# Altium schematic sheet Modulator.SchDoc: Audio modulator
size A4; Engineer: CT; SheetNumber: 3; SheetTotal: 4
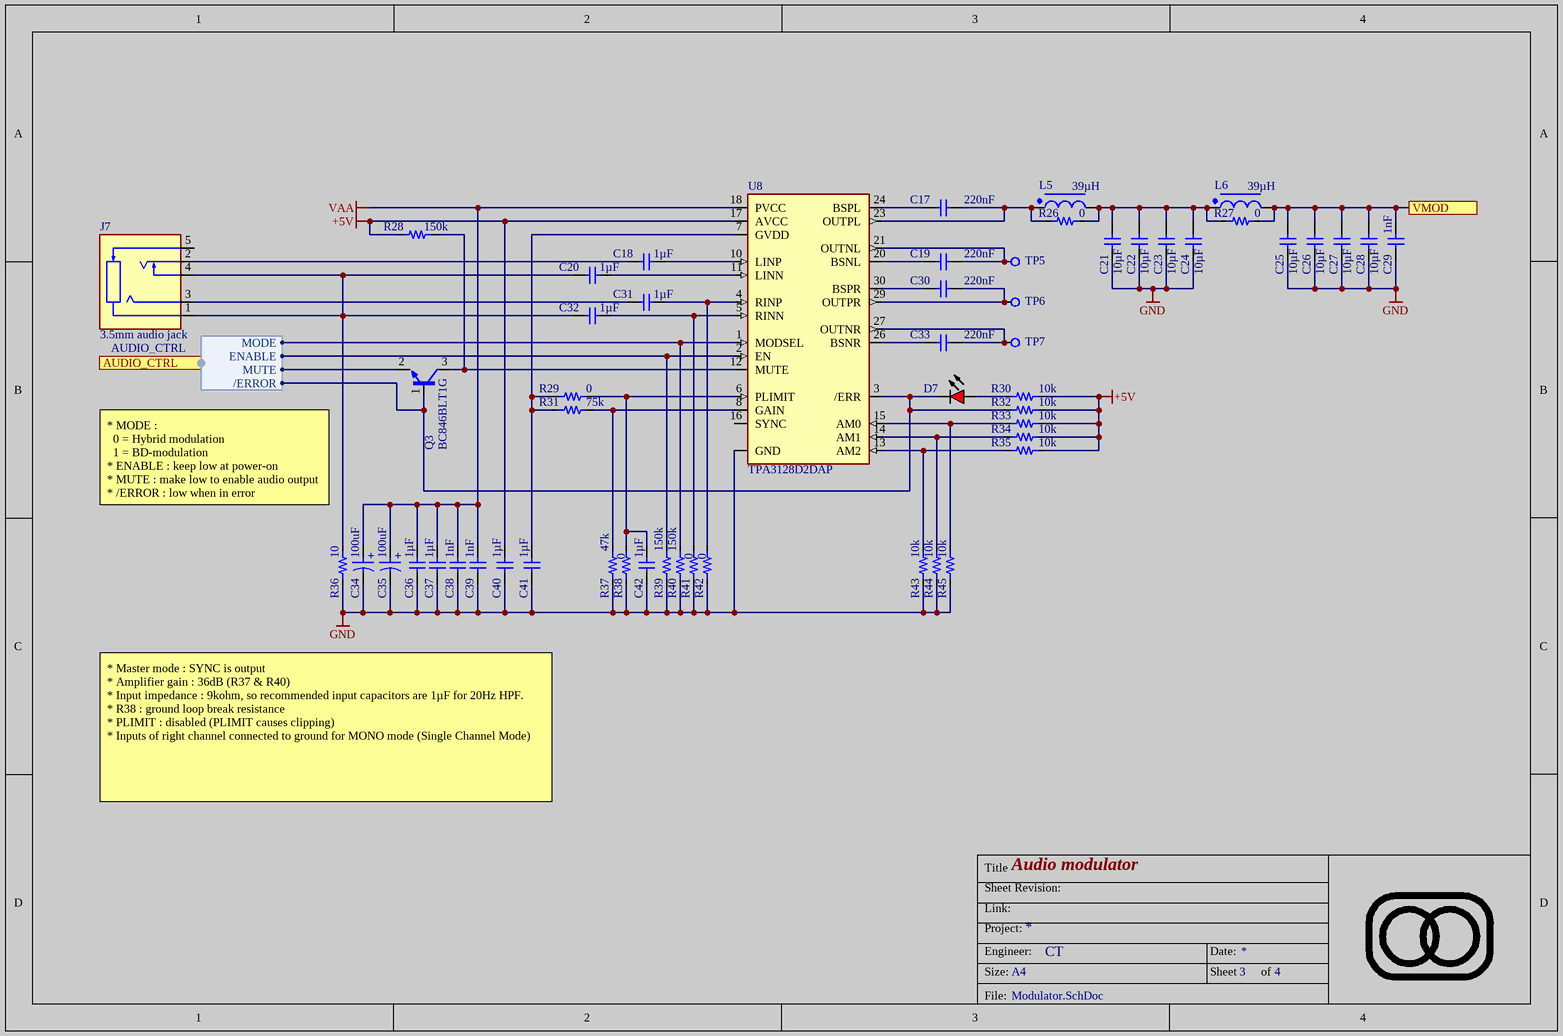
[diagram p0: Modulator.SchDoc]

## Parts
C17  value 220nF  [0805-C-N]  (hidden comment: Capacitor 220nF +/-10% 50V X7R 0805)
C18  value 1µF  [1206-C-N]  (hidden comment: Capacitor 1µF +/-10% 50V X7R 1206)
C19  value 220nF  [0805-C-N]  (hidden comment: Capacitor 220nF +/-10% 50V X7R 0805)
C20  value 1µF  [1206-C-N]  (hidden comment: Capacitor 1µF +/-10% 50V X7R 1206)
C21  value 10µF  [WCAP-CSGP_1210_L3.2W2.5H2.5]  (hidden comment: Capacitor 10µF +/-10% 50V X7R 1210)
C22  value 10µF  [WCAP-CSGP_1210_L3.2W2.5H2.5]  (hidden comment: Capacitor 10µF +/-10% 50V X7R 1210)
C23  value 10µF  [WCAP-CSGP_1210_L3.2W2.5H2.5]  (hidden comment: Capacitor 10µF +/-10% 50V X7R 1210)
C24  value 10µF  [WCAP-CSGP_1210_L3.2W2.5H2.5]  (hidden comment: Capacitor 10µF +/-10% 50V X7R 1210)
C25  value 10µF  [WCAP-CSGP_1210_L3.2W2.5H2.5]  (hidden comment: Capacitor 10µF +/-10% 50V X7R 1210)
C26  value 10µF  [WCAP-CSGP_1210_L3.2W2.5H2.5]  (hidden comment: Capacitor 10µF +/-10% 50V X7R 1210)
C27  value 10µF  [WCAP-CSGP_1210_L3.2W2.5H2.5]  (hidden comment: Capacitor 10µF +/-10% 50V X7R 1210)
C28  value 10µF  [WCAP-CSGP_1210_L3.2W2.5H2.5]  (hidden comment: Capacitor 10µF +/-10% 50V X7R 1210)
C29  value 1nF  [0603-C-N]  (hidden comment: Capacitor 1nF +/-10% 100V X7R 0603)
C30  value 220nF  [0805-C-N]  (hidden comment: Capacitor 220nF +/-10% 50V X7R 0805)
C31  value 1µF  [1206-C-N]  (hidden comment: Capacitor 1µF +/-10% 50V X7R 1206)
C32  value 1µF  [1206-C-N]  (hidden comment: Capacitor 1µF +/-10% 50V X7R 1206)
C33  value 220nF  [0805-C-N]  (hidden comment: Capacitor 220nF +/-10% 50V X7R 0805)
C34  Capacitance: 100uF  [WCAP-HSAH_D6.3H7.7]  (hidden comment: 875585545003)
C35  Capacitance: 100uF  [WCAP-HSAH_D6.3H7.7]  (hidden comment: 875585545003)
C36  value 1µF  [1206-C-N]  (hidden comment: Capacitor 1µF +/-10% 50V X7R 1206)
C37  value 1µF  [1206-C-N]  (hidden comment: Capacitor 1µF +/-10% 50V X7R 1206)
C38  value 1nF  [0603-C-N]  (hidden comment: Capacitor 1nF +/-10% 100V X7R 0603)
C39  value 1nF  [0603-C-N]  (hidden comment: Capacitor 1nF +/-10% 100V X7R 0603)
C40  value 1µF  [1206-C-N]  (hidden comment: Capacitor 1µF +/-10% 50V X7R 1206)
C41  value 1µF  [1206-C-N]  (hidden comment: Capacitor 1µF +/-10% 50V X7R 1206)
C42  value 1µF  [1206-C-N]  (hidden comment: Capacitor 1µF +/-10% 50V X7R 1206)
D7  150060RS86000  [WL-SMCW_0603_150060xx8x000]  (value not drawn)
J7  3.5mm audio jack  [SJ2-35863B1-SMT-TR-Footprint-1]
L5  Inductance: 39µH  [WE-PD2_1054]  (hidden comment: 744776139)
L6  Inductance: 39µH  [WE-PD2_1054]  (hidden comment: 744776139)
Q3  BC846BLT1G  [SOT-23-3-N]
R26  value 0  [1206-R-N]  (hidden comment: Jumper 0R <50 mOhm 2A 1206)
R27  value 0  [1206-R-N]  (hidden comment: Jumper 0R <50 mOhm 2A 1206)
R28  value 150k  [0603-R-N]  (hidden comment: Resistor 150k +/-1% 50V 0603)
R29  value 0  [0603-R-N]  (hidden comment: Jumper 0R <50 mOhm 1A 0603)
R30  value 10k  [0603-R-N]  (hidden comment: Resistor 10k +/-1% 50V 0603)
R31  value 75k  [0603-R-N]  (hidden comment: Resistor 75k +/-1% 50V 0603)
R32  value 10k  [0603-R-N]  (hidden comment: Resistor 10k +/-1% 50V 0603)
R33  value 10k  [0603-R-N]  (hidden comment: Resistor 10k +/-1% 50V 0603)
R34  value 10k  [0603-R-N]  (hidden comment: Resistor 10k +/-1% 50V 0603)
R35  value 10k  [0603-R-N]  (hidden comment: Resistor 10k +/-1% 50V 0603)
R36  value 10  [0603-R-N]  (hidden comment: Resistor 10R +/-1% 50V 0603)
R37  value 47k  [0603-R-N]  (hidden comment: Resistor 47k +/-1% 50V 0603)
R38  value 0  [0603-R-N]  (hidden comment: Jumper 0R <50 mOhm 1A 0603)
R39  value 150k  [0603-R-N]  (hidden comment: Resistor 150k +/-1% 50V 0603)
R40  value 150k  [0603-R-N]  (hidden comment: Resistor 150k +/-1% 50V 0603)
R41  value 0  [0603-R-N]  (hidden comment: Jumper 0R <50 mOhm 1A 0603)
R42  value 0  [0603-R-N]  (hidden comment: Jumper 0R <50 mOhm 1A 0603)
R43  value 10k  [0603-R-N]  (hidden comment: Resistor 10k +/-1% 50V 0603)
R44  value 10k  [0603-R-N]  (hidden comment: Resistor 10k +/-1% 50V 0603)
R45  value 10k  [0603-R-N]  (hidden comment: Resistor 10k +/-1% 50V 0603)
TP5  Testpad with multiple sizes  [TP_1.5mm]  (value not drawn)  (no BOM)
TP6  Testpad with multiple sizes  [TP_1.5mm]  (value not drawn)  (no BOM)
TP7  Testpad with multiple sizes  [TP_1.5mm]  (value not drawn)  (no BOM)
U8  TPA3128D2DAP  [TSSOP28_PPad]

## Ports
AUDIO_CTRL (harness AUDIO_CTRL), VMOD

## Harnesses
AUDIO_CTRL: MODE, ENABLE, MUTE, /ERROR

## Nets
+5V: C40.2 R28.1 R30.2 R32.1 R33.1 R34.1 R35.1 U8.17(AVCC)
GND: C21.1 C22.1 C23.1 C24.1 C25.1 C26.1 C27.1 C28.1 C29.1 C34.2(N) C35.2(N) C36.2 C37.2 C38.1 C39.1 C40.1 C41.1 C42.1 R36.1 R37.1 R38.1 R39.1 R40.1 R41.1 R42.1 R43.2 R44.2 R45.2 U8.9(GND)
VAA: C34.1(P) C35.1(P) C36.1 C37.1 C38.2 C39.2 U8.18(PVCC)
VMOD: C25.2 C26.2 C27.2 C28.2 C29.2 L6.2 R27.2 ; port VMOD
NetC17_1: C17.1 U8.24(BSPL)
NetC17_2: C17.2 L5.1 R26.1 U8.23(OUTPL)
NetC18_1: C18.1 U8.10(LINP)
NetC18_2: C18.2 J7.2
NetC19_1: C19.1 U8.20(BSNL)
NetC19_2: C19.2 TP5.1(Pad) U8.21(OUTNL)
NetC20_1: C20.1 U8.11(LINN)
NetC20_2: C20.2 C32.2 J7.1 J7.4 R36.2
NetC21_2: C21.2 C22.2 C23.2 C24.2 L5.2 L6.1 R26.2 R27.1
NetC30_1: C30.1 U8.30(BSPR)
NetC30_2: C30.2 TP6.1(Pad) U8.29(OUTPR)
NetC31_1: C31.1 R42.2 U8.4(RINP)
NetC31_2: C31.2 J7.3
NetC32_1: C32.1 R41.2 U8.5(RINN)
NetC33_1: C33.1 U8.26(BSNR)
NetC33_2: C33.2 TP7.1(Pad) U8.27(OUTNR)
NetC41_2: C41.2 R29.1 R31.2 U8.7(GVDD)
NetC42_2: C42.2 R29.2 R38.2 U8.6(PLIMIT)
NetD7_1: D7.1(K) Q3.1(B) R32.2 U8.3(/ERR) ; port AUDIO_CTRL./ERROR
NetD7_2: D7.2(A) R30.1
NetQ3_2: Q3.2(E) ; port AUDIO_CTRL.MUTE
NetQ3_3: Q3.3(C) R28.2 U8.12(MUTE)
NetR31_1: R31.1 R37.2 U8.8(GAIN)
NetR33_2: R33.2 R45.1 U8.15(AM0)
NetR34_2: R34.2 R44.1 U8.14(AM1)
NetR35_2: R35.2 R43.1 U8.13(AM2)
NetR39_2: R39.2 U8.2(EN) ; port AUDIO_CTRL.ENABLE
NetR40_2: R40.2 U8.1(MODSEL) ; port AUDIO_CTRL.MODE

Not connected (* = marked no-connect by the designer): J7 5; U8 16(SYNC)

## Notes on the sheet
- * MODE :
  0 = Hybrid modulation
  1 = BD-modulation
  * ENABLE : keep low at power-on
  * MUTE : make low to enable audio output
  * /ERROR : low when in error
- * Master mode : SYNC is output
  * Amplifier gain : 36dB (R37 & R40)
  * Input impedance : 9kohm, so recommended input capacitors are 1µF for 20Hz HPF.
  * R38 : ground loop break resistance
  * PLIMIT : disabled (PLIMIT causes clipping)
  * Inputs of right channel connected to ground for MONO mode (Single Channel Mode)
- Title
- Sheet Revision:
- Link:
- Size:
- Project:
- Engineer:
- A4
- Date:
- Sheet
- of
- File:
- (in symbol CMP-171-000008-2) +

## Library data of the parts
C17 C19 C30 C33 = CMP-072-000738-14: WCAP-CSGP Multilayer Ceramic Chip Capacitor, General Purpose, size 0805, X7R, 220nF, 50VDC; Capacitor Type: MLCC; Technical Reference: X7R0805224K050DFCT10000; Insulation Resistance: 2.3GO; Dissipation Factor: 3%; Tolerance: 10%; Width: 1.25mm; Dielectric: X7R; Case/Package: 0805; ComponentLink2Description: Datasheet Link; Usage: General Purpose; Pins: 2; JLCPCB Part #: C5378; Design Item ID: 885012207100; ComponentLink2URL: https://www.we-online.com/redexpert/spec/885012207100?ad; Max Operating Temperature: 125°C; Length: 2mm; Source: WCAP-CSGP.SchLib; Packaging: Tape and Reel; ComponentLink1URL: https://www.we-online.com/redexpert/article/885012207100?ad; Match Code: WCAP-CSGP; Voltage Rating: 50V; ComponentLink1Description: Website Link; Mounting Technology: SMT; Height: 1.25mm; Min Operating Temperature: -55°C
C18 C20 C31 C32 C36 C37 C40-C42 = CMP-072-000852-14: WCAP-CSGP Multilayer Ceramic Chip Capacitor, General Purpose, size 1206, X7R, 1µF, 50VDC; Dissipation Factor: 3%; Tolerance: 10%; Technical Reference: X7R1206105K050DFCT10000; Insulation Resistance: 0.5GO; Capacitor Type: MLCC; Mounting Technology: SMT; ComponentLink2Description: Datasheet Link; Width: 1.6mm; Length: 3.2mm; Match Code: WCAP-CSGP; Voltage Rating: 50V; Packaging: Tape and Reel; ComponentLink1Description: Website Link; ComponentLink2URL: https://www.we-online.com/redexpert/spec/885012208093?ad; Pins: 2; Height: 1.6mm; Max Operating Temperature: 125°C; Min Operating Temperature: -55°C; Dielectric: X7R; Design Item ID: 885012208093; Source: WCAP-CSGP.SchLib; Usage: General Purpose; JLCPCB Part #: C1848; Case/Package: 1206; ComponentLink1URL: https://www.we-online.com/redexpert/article/885012208093?ad
C21-C28 = CMP-072-000922-14: WCAP-CSGP Multilayer Ceramic Chip Capacitor, General Purpose, size 1210, X7R, 10µF, 50VDC; Tolerance: 10%; Technical Reference: X7R1210106K050DFCT10000; Insulation Resistance: 0.01GO; Capacitor Type: MLCC; ComponentLink2URL: https://www.we-online.com/redexpert/spec/885012209073?ad; ComponentLink1URL: https://www.we-online.com/redexpert/article/885012209073?ad; Source: WCAP-CSGP.SchLib; Case/Package: 1210; Packaging: Tape and Reel; ComponentLink1Description: Website Link; Pins: 2; Width: 2.5mm; Voltage Rating: 50V; ComponentLink2Description: Datasheet Link; Match Code: WCAP-CSGP; Max Operating Temperature: 125°C; Usage: General Purpose; JLCPCB Part #: C2918502; Height: 2.5mm; Dielectric: X7R; Dissipation Factor: 10%; Length: 3.2mm; Min Operating Temperature: -55°C; Design Item ID: 885012209073; Mounting Technology: SMT
C29 C38 C39 = CMP-072-000626-14: WCAP-CSGP Multilayer Ceramic Chip Capacitor, General Purpose, size 0603, X7R, 1nF, 100VDC; Capacitor Type: MLCC; Insulation Resistance: 10GO; Technical Reference: X7R0603102K100DFCT10000; Dissipation Factor: 2.5%; Tolerance: 10%; Voltage Rating: 100V; ComponentLink2Description: Datasheet Link; ComponentLink2URL: https://www.we-online.com/redexpert/spec/885012206108?ad; JLCPCB Part #: C182247; ComponentLink1Description: Website Link; Usage: General Purpose; Height: 0.8mm; Width: 0.8mm; Source: WCAP-CSGP.SchLib; Match Code: WCAP-CSGP; Pins: 2; Length: 1.6mm; ComponentLink1URL: https://www.we-online.com/redexpert/article/885012206108?ad; Dielectric: X7R; Packaging: Tape and Reel; Design Item ID: 885012206108; Case/Package: 0603; Min Operating Temperature: -55°C; Max Operating Temperature: 125°C; Mounting Technology: SMT
C34 C35 = CMP-171-000008-2: WCAP-HSAH Aluminum Hybrid Polymer Capacitor, SMT, D6.3 x H7.7mm, 100uF, 25V; Manufacturer: Wurth Elektronik; Leakage Current: 25uA; Dissipation Factor: 14%; Ripple Current: 1400mA; ESR: 30mOhm; Endurance: 4000h; Packaging: Tape and Reel; ComponentLink2Description: Datasheet Link; Design Item ID: 875585545003; ComponentLink1Description: Website Link; Diameter: 6.3mm; JLCPCB Part #: C22395169; Category: Aluminum Hybrid Polymer Capacitors; Manufacturer Part Number: 875585545003; Operating Temperature Min: -55°C; Mount: Surface Mount; Component Type: Standard; Rated Voltage (DC): 25V; Source: WCAP-HSAH.SchLib; Height: 7.7mm; Pin Count: 2; Operating Temperature Max: 125°C; ComponentLink2URL: https://www.we-online.com/redexpert/spec/875585545003?ad; Match Code: WCAP-HSAH; ComponentLink1URL: https://www.we-online.com/redexpert/article/875585545003?ad
D7 = CMP-002-001080-9: WL-SMCW Mono-color Chip LED Waterclear, size 0603, Red, 2V, 60°; Manufacturer: Wurth Elektronik; Case/Size Code: 0603; Dominant Wavelength: 624nm; Peak Wavelength: 632nm; Luminous Intensity: 800mcd; Chip Technology: AlInGaP; Match Code: WL-SMCW; Source: WL-SMCW.SchLib; Length: 1.6mm; Height: 0.95mm; Emitting Color: Red; Forward Voltage: 2V; ComponentLink1URL: https://www.we-online.com/redexpert/article/150060RS86000?ad; Operating Temperature Min: -40°C; Mount: Surface Mount; Pin Count: 2; Design Item ID: 150060RS86000; ComponentLink1Description: Website Link; Packaging: Tape and Reel; ComponentLink2URL: https://www.we-online.com/redexpert/spec/150060RS86000?ad; JLCPCB Part #: C5875741; Operating Temperature Max: 85°C; Manufacturer Part Number: 150060RS86000; ComponentLink2Description: Datasheet Link; Viewing Angle: 60°; Category: Signal LEDs; Component Type: Standard; Width: 0.8mm
J7 = CMP-002-00128-4: 3.5 mm, Stereo, Right Angle, Surface Mount (SMT), Audio Jack Connector; Number of Ports: 1; Number of Conductors: 3; Shielding: Unshielded; JLCPCB Part #: C381135; Color: Black; Orientation: Horizontal; Connector Type: Jack; Value: 3.5mm audio jack
L5 L6 = CMP-167-000094-2: WE-PD2 SMT Power Inductor, size 1054, 39µH, 1.62A, 0.14O; Manufacturer: Wurth Elektronik; Self Resonant Frequency: 12MHz; Saturation Current: 1.8A; Case/Size Code: 1054; DC Resistance: 0.098O; Width: 9mm; Source: WE-PD2.SchLib; Operating Temperature Max: 125°C; ComponentLink2Description: Datasheet Link; Match Code: WE-PD2; Height: 5.4mm; Category: Unshielded Power Inductors; Operating Temperature Min: -40°C; Mount: Surface Mount; Rated Current: 1.62A; Design Item ID: 744776139; Manufacturer Part Number: 744776139; DC Resistance Max: 0.14O; ComponentLink1URL: https://www.we-online.com/redexpert/article/744776139?ad; JLCPCB Part #: -; Packaging: Tape and Reel; ComponentLink2URL: https://www.we-online.com/redexpert/spec/744776139?ad; Component Type: Standard; Length: 10mm; ComponentLink1Description: Website Link; Pin Count: 2
Q3 = CMP-013-00048-14: NPN Ic=100mA Vceo=65V hfe=200~450 P=225mW SOT-23; Ic Max: 100mA; Vce Max: 65V; Case/Package: SOT-23-3; Transistor Type: NPN; JLCPCB Part #: C82477
R26 R27 = CMP-009-00002-23: Chip Jumper, Thick Film, Jumper, 1206, 250mW, 2A, 0 Ohm, <50 mOhm; Elements: 1; Voltage Rating: 200V; Tolerance: 50 mOhm; Pins: 2; Usage: Jumper; Current Rating: 2A; Max Operating Temperature: 155°C; JLCPCB Part #: C17888; Min Operating Temperature: -55°C; Mounting Technology: SMT; RoHS Compliant: True; Resistor Type: Thick Film; Power Rating: 250mW; Case/Package: 1206
R28 R39 R40 = CMP-009-00237-19: Chip Resistor, Thick Film, General Purpose, 0603, 100mW, 50V, 150 kOhm, +/-1%; FLIR Part #: YRES150K-1; Tolerance: 1%; Elements: 1; Min Operating Temperature: -55°C; Voltage Rating: 50V; Max Operating Temperature: 155°C; Resistor Type: Thick Film; JLCPCB Part #: C22807; Pins: 2; RoHS Compliant: Yes; Usage: General Purpose; Mounting Technology: SMT; Power Rating: 100mW; Case/Package: 0603
R29 R38 R41 R42 = CMP-009-00006-25: Chip Jumper, Thick Film, Jumper, 0603, 100mW, 1A, 0 Ohm, <50 mOhm; FLIR Part #: YRES0E-1; Tolerance: 50 mOhm; Voltage Rating: 75V; Elements: 1; Usage: Jumper; Case/Package: 0603; Power Rating: 100mW; Current Rating: 1A; Min Operating Temperature: -55°C; RoHS Compliant: True; Resistor Type: Thick Film; Max Operating Temperature: 155°C; JLCPCB Part #: C21189; Pins: 2; Mounting Technology: SMT
R30 R32-R35 R43-R45 = CMP-009-00017-27: Chip Resistor, Thick Film, General Purpose, 0603, 100mW, 50V, 10 kOhm, +/-1%; FLIR Part #: YRES10K-1; Elements: 1; Tolerance: 1%; Usage: General Purpose; Voltage Rating: 50V; RoHS Compliant: Yes; JLCPCB Part #: C25804; Power Rating: 100mW; Pins: 2; Min Operating Temperature: -55°C; Resistor Type: Thick Film; Case/Package: 0603; Max Operating Temperature: 155°C; Mounting Technology: SMT
R31 = CMP-009-00319-10: Chip Resistor, Thick Film, General Purpose, 0603, 100mW, 50V, 75 kOhm, +/-1%; Tolerance: 1%; Elements: 1; Pins: 2; Resistor Type: Thick Film; Case/Package: 0603; JLCPCB Part #: C23242; Max Operating Temperature: 155°C; Mounting Technology: SMT; RoHS Compliant: Yes; Voltage Rating: 50V; Usage: General Purpose; Power Rating: 100mW; Min Operating Temperature: -55°C
R36 = CMP-009-00230-18: Chip Resistor, Thick Film, General Purpose, 0603, 100mW, 50V, 10 Ohm, +/-1%; Tolerance: 1%; Elements: 1; Temperature Coefficient: 200ppm/°C; Pins: 2; Max Operating Temperature: 155°C; Mounting Technology: SMT; RoHS Compliant: Yes; JLCPCB Part #: C22859; Voltage Rating: 50V; Case/Package: 0603; Resistor Type: Thick Film; Min Operating Temperature: -55°C; Power Rating: 100mW; Usage: General Purpose
R37 = CMP-009-00195-21: Chip Resistor, Thick Film, General Purpose, 0603, 100mW, 50V, 47 kOhm, +/-1%; FLIR Part #: YRES47K-1; Tolerance: 1%; Elements: 1; Temperature Coefficient: 100ppm/°C; Voltage Rating: 50V; Case/Package: 0603; Usage: General Purpose; Min Operating Temperature: -55°C; JLCPCB Part #: C25819; REACH SVHC: No SVHC; Pins: 2; Mounting Technology: SMT; Max Operating Temperature: 155°C; Power Rating: 100mW; Resistor Type: Thick Film
TP5-TP7 = CMP-027-000000-15: Testpad land; Source: 7c7_Connectors.SchLib; Component Type: Standard; Design Item ID: Testpad; Pin Count: 1
U8 = CMP-014-00029-7: Audio Amp Speaker 1-CH Mono/2-CH Stereo 60W Class-D 32-Pin HTSSOP EP Tube; pin to pad: 9>9+22+25+28+33 18>18+19+31+32; Max Output Power: 30W; Max Operating Temperature: 85°C; JLCPCB Part #: C473362; Series: -; Packaging: Rail/Tube; RoHS Compliant: Yes; Case/Package: HTSSOP; Min Operating Temperature: -40°C; Mounting Technology: Surface Mount